# Altium schematic sheet PPT Primary Side.SchDoc
size Letter; DocumentNumber: 3; SheetNumber: 3; SheetTotal: 3
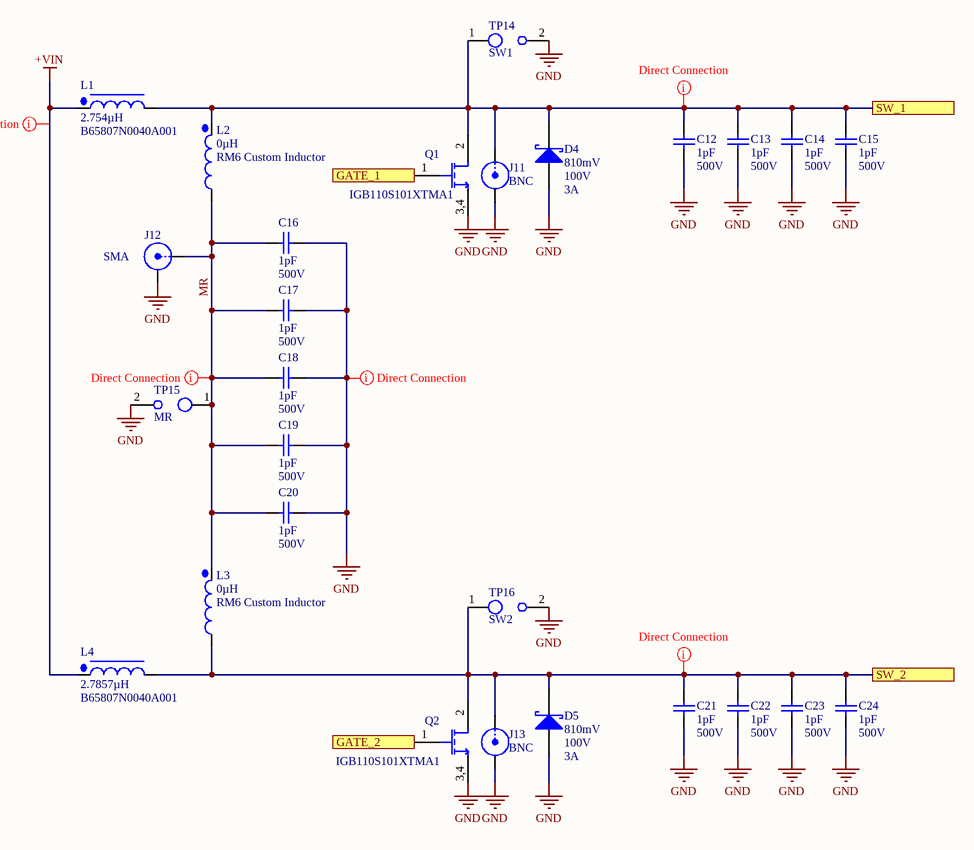
[diagram p0: PPT Primary Side.SchDoc]

## Parts
C12  value 1pF  Voltage: 500V  [CAP_1111_ATC 800B]  (hidden comment: 800B1R0BT500XT1K)
C13  value 1pF  Voltage: 500V  [CAP_1111_ATC 800B]  (hidden comment: 800B1R0BT500XT1K)
C14  value 1pF  Voltage: 500V  [CAP_1111_ATC 800B]  (hidden comment: 800B1R0BT500XT1K)
C15  value 1pF  Voltage: 500V  [CAP_1111_ATC 800B]  (hidden comment: 800B1R0BT500XT1K)
C16  value 1pF  Voltage: 500V  [CAP_1111_ATC 800B]  (hidden comment: 800B1R0BT500XT1K)
C17  value 1pF  Voltage: 500V  [CAP_1111_ATC 800B]  (hidden comment: 800B1R0BT500XT1K)
C18  value 1pF  Voltage: 500V  [CAP_1111_ATC 800B]  (hidden comment: 800B1R0BT500XT1K)
C19  value 1pF  Voltage: 500V  [CAP_1111_ATC 800B]  (hidden comment: 800B1R0BT500XT1K)
C20  value 1pF  Voltage: 500V  [CAP_1111_ATC 800B]  (hidden comment: 800B1R0BT500XT1K)
C21  value 1pF  Voltage: 500V  [CAP_1111_ATC 800B]  (hidden comment: 800B1R0BT500XT1K)
C22  value 1pF  Voltage: 500V  [CAP_1111_ATC 800B]  (hidden comment: 800B1R0BT500XT1K)
C23  value 1pF  Voltage: 500V  [CAP_1111_ATC 800B]  (hidden comment: 800B1R0BT500XT1K)
C24  value 1pF  Voltage: 500V  [CAP_1111_ATC 800B]  (hidden comment: 800B1R0BT500XT1K)
D4  Forward Voltage: 810mV  Reverse Standoff Voltage: 100V  Max Output current: 3A  [ST-SOD128FL]  (hidden comment: RB058LAM100TFTR)
D5  Forward Voltage: 810mV  Reverse Standoff Voltage: 100V  Max Output current: 3A  [ST-SOD128FL]  (hidden comment: RB058LAM100TFTR)
J11  BNC  [112404-Footprint-1]
J12  SMA  [FP-RF2-04A-T-00-50-G-MFG]
J13  BNC  [112404-Footprint-1]
L1  B65807N0040A001  value 2.754µH  [B65808N1006D001-Alt2-Footprint-1]
L2  RM6 Custom Inductor  value 0µH  [B65808N1006D001-Alt2-Footprint-1]
L3  RM6 Custom Inductor  value 0µH  [B65808N1006D001-Alt2-Footprint-1]
L4  B65807N0040A001  value 2.7857µH  [B65808N1006D001-Alt2-Footprint-1]
Q1  IGB110S101XTMA1  [IGB110S101XTMA1-Footprint-1]
Q2  IGB110S101XTMA1  [IGB110S101XTMA1-Footprint-1]
TP14  NetName: SW1  [No Silk Test Point - Scope with Ground Spring-Footprint-1]  (hidden comment: Test Point - Scope with Ground Spring (No Socket))  (no BOM)
TP15  NetName: MR  [No Silk Test Point - Scope with Ground Spring-Footprint-1]  (hidden comment: Test Point - Scope with Ground Spring (No Socket))  (no BOM)
TP16  NetName: SW2  [No Silk Test Point - Scope with Ground Spring-Footprint-1]  (hidden comment: Test Point - Scope with Ground Spring (No Socket))  (no BOM)

## Ports
GATE_1 (in), GATE_2 (in), SW_1, SW_2

## Nets
+VIN: L1.1 L4.1
GND: C12.1 C13.1 C14.1 C15.1 C16.2 C17.2 C18.2 C19.2 C20.2 C21.1 C22.1 C23.1 C24.1 D4.A D5.A J11.2(SHELL) J12.2(SHELL) J13.2(SHELL) Q1.3,4(S) Q2.3,4(S) TP14.2(GND) TP15.2(GND) TP16.2(GND)
GATE_1: Q1.1(G) ; port GATE_1
GATE_2: Q2.1(G) ; port GATE_2
MR: C16.1 C17.1 C18.1 C19.1 C20.1 J12.1 L2.2 L3.1 TP15.1(Signal)
SW_1: C12.2 C13.2 C14.2 C15.2 D4.K J11.1 L1.2 L2.1 Q1.2(D) TP14.1(Signal) ; port SW_1
SW_2: C21.2 C22.2 C23.2 C24.2 D5.K J13.1 L3.2 L4.2 Q2.2(D) TP16.1(Signal) ; port SW_2

## Layout directives
net class Direct Connection: +VIN, GND, MR, SW_1, SW_2

## Notes on the sheet
- Title:
- Desc:
- Size:
- Letter
- Auth:
- Sheet
- of
- www.seas.upenn.edu
- Electrical and Systems Engineering
- Proj:

## Library data of the parts
C12-C24 = CMP-001-00029-1: Ceramic Capacitor, Multilayer, Ceramic, 500V, 50% +Tol, 50% -Tol, C0G, 30ppm/Cel TC, 0.000001uF, Surface Mount, 1111; Lifecycle Status: Production; Dielectric Material: Ceramic; RoHS: Compliant; Mount: SMD; REACH SVHC: Yes; Max Operating Temperature: 125°C; Mounting Technology: Surface Mount; Case/Package: 1111; Capacitor Type: Ceramic; Voltage Rating (DC): 500V; Min Operating Temperature: -55°C; China RoHS: Compliant; Width: 2.79mm; Height: 1.78mm; Length: 2.79mm; Number of Terminals: 2
D4 D5 = CMP-00827-1: Rectifier Diode, Schottky, 1 Phase, 1 Element, 3A, 100V V(RRM), Silicon; Max Forward Surge Current (Ifsm): 80A; Peak Reverse Current: 3µA; Number of Elements: 1; REACH SVHC: No; Lifecycle Status: Production; Number of Terminals: 2; Max Operating Temperature: 150°C; China RoHS: Non-Compliant; RoHS: Compliant; Mounting Technology: Surface Mount
J11 J13 = CMP-00805-2: BNC Connector Jack, Female Socket 50 Ohms Through Hole Solder; Body Plating: Nickel; Body Material: Brass; Frequency: 3GHz; Connector Type: BNC, Coaxial, Receptacle, Socket; Voltage Rating: 500V; Clock Frequency: 4GHz; Impedance: 50Ω; Gender: Male; Value: 50Ω; Insulation Resistance: 5GΩ; Orientation: Straight; Contact Gender: Female; Fastening Type: Bayonet; Contact Plating: Gold; Housing Color: Silver; Max Operating Temperature: 165°C; Mounting Technology: PCB, Through Hole; Contact Material: Bronze; Insulation Material: Polytetrafluoroethylene; REACH SVHC: Unknown; Termination: Solder; Weight: 4.025009g; Lead Free: Lead Free; Min Operating Temperature: -65°C; Lifecycle Status: Production; RoHS: Compliant; Radiation Hardening: No
J12 = CMP-00789-4: Connector SMA Jack 0Hz to 6GHz 50Ohm Solder ST Thru-Hole F Gold; Impedance: 50Ω; Number of Contacts: 1; Voltage Rating: 500V; Dielectric Material: PTFE; RoHS: Compliant; Lifecycle Status: Production; REACH SVHC: Yes; Contact Material: Gold; Min Operating Temperature: -65°C; Frequency: 6GHz; Height: 10.3378mm; Schedule B: 8536695050; Max Operating Temperature: 165°C
L1-L4 = CMP-00815-11: BOBBIN COIL FORMER RM 6; pin to pad: 1>1+2+6 2>3+4+5
Q1 Q2 = CMP-00811-1: 100 V 23 A 9.4 mOhm N-Channel PQFN 3x3 GaN MOSFET; pin to pad: 3,4>3+4; Continuous Drain Current (ID): 23A; Drain to Source Resistance: 11mΩ; Max Power Dissipation: 15W; Number of Elements: 1; Min Breakdown Voltage: 100V; Number of Terminals: 4; Max Operating Temperature: 150°C; Min Operating Temperature: -40°C; Lifecycle Status: Production; REACH SVHC: Yes; RoHS: Compliant
TP14-TP16 = CMP-00799-3: Testpoint for scope probe with a ground spring; Probe tip 0.032in-0.046in; 0.350in Ground Spring Clearance (placed at 0.3in)